# Altium schematic sheet DE-130817_01.SchDoc: Cuc & Com
size A3; Author: eldar6776@hotmail.com; DrawnBy: Eldar Dedic; Organization: I-MEDIA GROUP d.o.o.; Address1: Topal Osman Paše 18; Address2: 71000 Sarajevo; Address3: Federacija BiH; Address4: Bosna i Hercegovina; DocumentNumber: DE-130817; Revision: 001
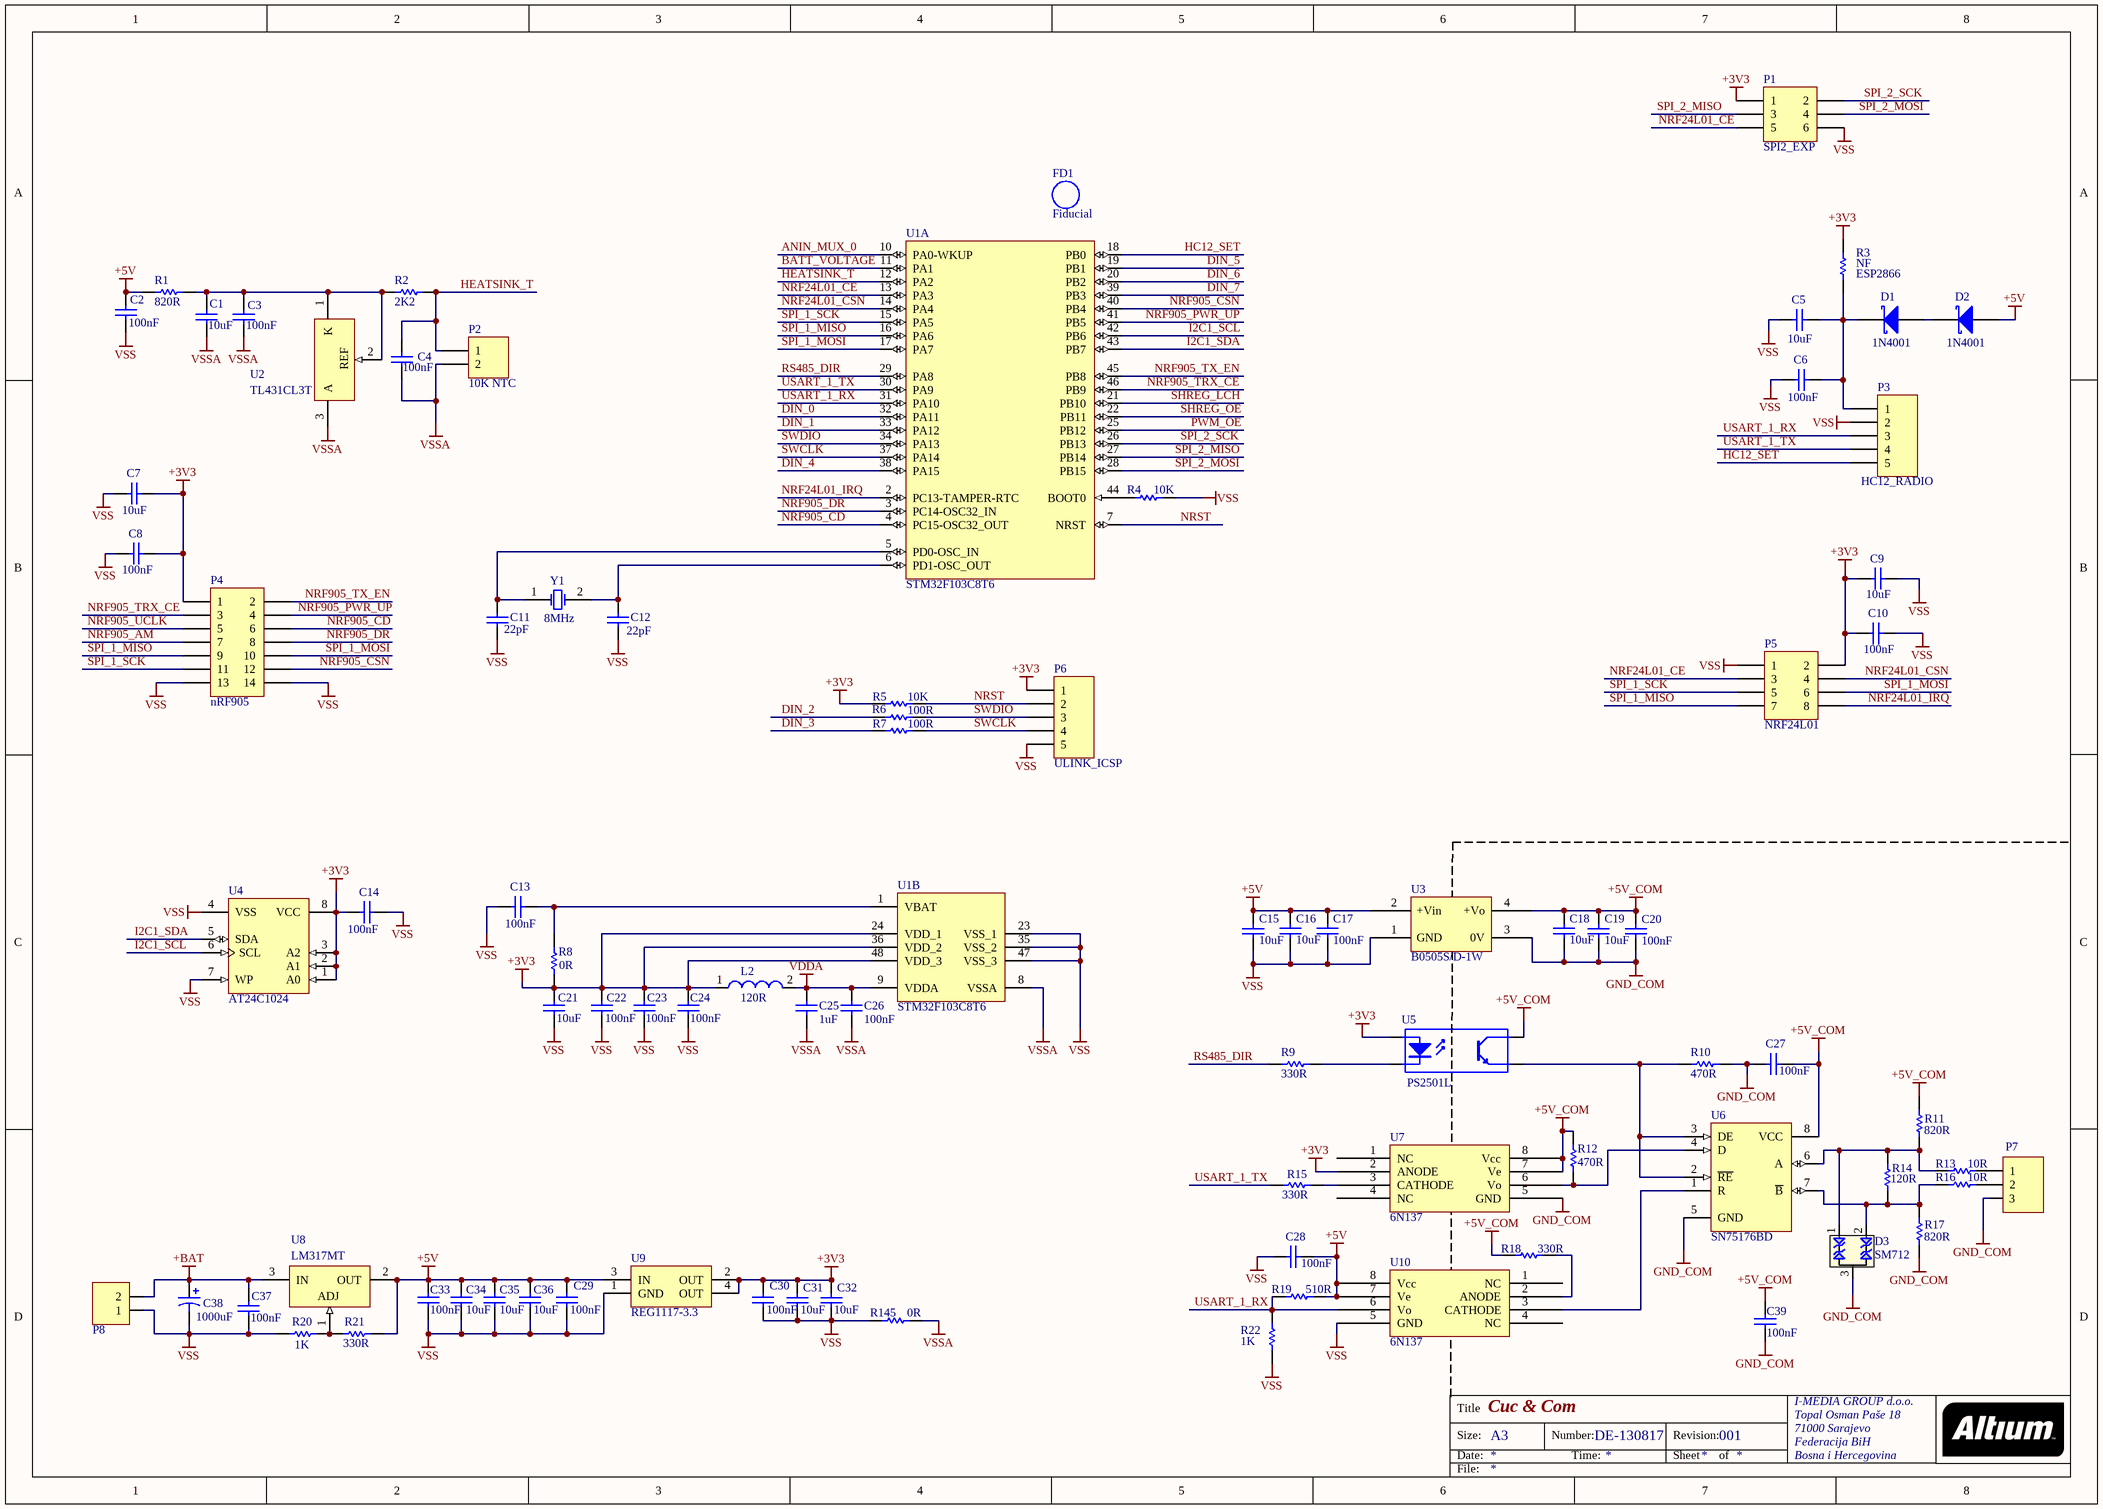
[diagram p0: DE-130817_01.SchDoc]

## Parts
C1  10uF  [0805]
C2  100nF  [0603]
C3  100nF  [0603]
C4  100nF  [0603]
C5  10uF  [0805]
C6  100nF  [0603]
C7  10uF  [0805]
C8  100nF  [0603]
C9  10uF  [0805]
C10  100nF  [0603]
C11  22pF  [0603]
C12  22pF  [0603]
C13  100nF  [0603]
C14  100nF  [0603]
C15  10uF  [0805]
C16  10uF  [0805]
C17  100nF  [0603]
C18  10uF  [0805]
C19  10uF  [0805]
C20  100nF  [0603]
C21  10uF  [0805]
C22  100nF  [0603]
C23  100nF  [0603]
C24  100nF  [0603]
C25  1uF  [0603]
C26  100nF  [0603]
C27  100nF  [0603]
C28  100nF  [0603]
C29  100nF  [0603]
C30  100nF  [0603]
C31  10uF  [0805]
C32  10uF  [0805]
C33  100nF  [0603]
C34  10uF  [0805]
C35  10uF  [0805]
C36  10uF  [0805]
C37  100nF  [0603]
C38  1000uF  [CAPPR5-10x16]
C39  100nF  [0603]
D1  1N4001  [SMA]
D2  1N4001  [SMA]
D3  SM712  [SOT23_3L]
FD1  Fiducial  [Fiducial]  (no BOM)
L2  120R  [SMD-0805]
P1  SPI2_EXP  [HDR2X3]
P2  10K NTC  [HDR1X2]
P3  HC12_RADIO  [HDR1X5]
P4  nRF905  [HDR2X7]
P5  NRF24L01  [HDR2X4]
P6  ULINK_ICSP  [HDR1X5]
P7  TERMINAL BLOK 3  [TERMINAL BLOK 3]  (value not drawn)
P8  TERMINAL BLOK 2  [TERMINAL BLOK 2]  (value not drawn)
R1  820R  [ERA-0603]
R2  2K2  [ERA-0603]
R3  NF  [ERA-0603]
R4  10K  [ERA-0603]
R5  10K  [ERA-0603]
R6  100R  [ERA-0603]
R7  100R  [ERA-0603]
R8  0R  [ERA-0603]
R9  330R  [ERA-0603]
R10  470R  [ERA-0603]
R11  820R  [ERA-0805]
R12  470R  [ERA-0603]
R13  10R  [ERA-0805]
R14  120R  [ERA-0805]
R15  330R  [ERA-0603]
R16  10R  [ERA-0805]
R17  820R  [ERA-0805]
R18  330R  [ERA-0603]
R19  510R  [ERA-0603]
R20  1K  [ERA-0805]
R21  330R  [ERA-0805]
R22  1K  [ERA-0603]
R145  0R  [ERA-0603]
U1  STM32F103C8T6  [STM-LQFP48_N]  (parts A,B of 2)
U2  TL431CL3T  [SOT23-3_N]
U3  B0505S/D-1W  [B0505S-1W]
U4  AT24C1024  [SOIC-SN8_N]
U5  PS2501L  [SOP4]
U6  SN75176BD  [D008_L]
U7  6N137  [SMD-8]
U8  LM317MT  [221A-06]
U9  REG1117-3.3  [ZZ311]
U10  6N137  [SMD-8]
Y1  8MHz  [HC49/4H_SMX]

## Nets
+3V3: C7.1 C8.1 C9.1 C10.1 C14.1 C21.2 C22.2 C23.2 C24.2 C30.2 C31.2 C32.2 L2.1 P1.1 P4.1 P5.2 P6.1 R3.2 R5.2 R8.2 U1.24(VDD_1) U1.36(VDD_2) U1.48(VDD_3) U4.1(A0) U4.2(A1) U4.3(A2) U4.8(VCC) U5.1(A) U7.2(ANODE) U9.2(OUT) U9.4(OUT)
+5V: C2.2 C15.2 C16.2 C17.2 C28.1 C29.2 C33.2 C34.2 C35.2 C36.2 D2.1(A) R1.2 R19.1 R21.1 U3.2(+Vin) U8.2(OUT) U9.3(IN) U10.7(Ve) U10.8(Vcc)
+5V_COM: C18.2 C19.2 C20.2 C27.2 C39.1 R11.2 R12.1 R18.2 U3.4(+Vo) U5.4(C) U6.8(VCC) U7.7(Ve) U7.8(Vcc)
+BAT: C37.2 C38.1 P8.2 U8.3(IN)
GND_COM: C18.1 C19.1 C20.1 C27.1 C39.2 D3.3(GND) P7.3 R10.2 R17.1 U3.3(0V) U6.5(GND) U7.5(GND)
VDDA: C25.2 C26.2 L2.2 U1.9(VDDA)
VSS: C2.1 C5.2 C6.2 C7.2 C8.2 C9.2 C10.2 C11.1 C12.1 C13.2 C14.2 C15.1 C16.1 C17.1 C21.1 C22.1 C23.1 C24.1 C28.2 C29.1 C30.1 C31.1 C32.1 C33.1 C34.1 C35.1 C36.1 C37.1 C38.2 P1.6 P3.2 P4.13 P4.14 P5.1 P6.5 P8.1 R4.2 R20.2 R22.1 R145.1 U1.23(VSS_1) U1.35(VSS_2) U1.47(VSS_3) U3.1(GND) U4.4(VSS) U4.7(WP) U9.1(GND) U10.5(GND)
VSSA: C1.1 C3.1 C4.1 C25.1 C26.1 P2.2 R145.2 U1.8(VSSA) U2.3(A)
ANIN_MUX_0: U1.10(PA0-WKUP)
BATT_VOLTAGE: U1.11(PA1)
DIN_0: U1.32(PA11)
DIN_1: U1.33(PA12)
DIN_2: R6.2
DIN_3: R7.2
DIN_4: U1.38(PA15)
DIN_5: U1.19(PB1)
DIN_6: U1.20(PB2)
DIN_7: U1.39(PB3)
HC12_SET: P3.5 U1.18(PB0)
HEATSINK_T: C4.2 P2.1 R2.1 U1.12(PA2)
I2C1_SCL: U1.42(PB6) U4.6(SCL)
I2C1_SDA: U1.43(PB7) U4.5(SDA)
NRF24L01_CE: P1.5 P5.3 U1.13(PA3)
NRF24L01_CSN: P5.4 U1.14(PA4)
NRF24L01_IRQ: P5.8 U1.2(PC13-TAMPER-RTC)
NRF905_AM: P4.7
NRF905_CD: P4.6 U1.4(PC15-OSC32_OUT)
NRF905_CSN: P4.12 U1.40(PB4)
NRF905_DR: P4.8 U1.3(PC14-OSC32_IN)
NRF905_PWR_UP: P4.4 U1.41(PB5)
NRF905_TRX_CE: P4.3 U1.46(PB9)
NRF905_TX_EN: P4.2 U1.45(PB8)
NRF905_UCLK: P4.5
NRST: P6.2 R5.1 U1.7(NRST)
PWM_OE: U1.25(PB12)
RS485_DIR: R9.2 U1.29(PA8)
SHREG_LCH: U1.21(PB10)
SHREG_OE: U1.22(PB11)
SPI_1_MISO: P4.9 P5.7 U1.16(PA6)
SPI_1_MOSI: P4.10 P5.6 U1.17(PA7)
SPI_1_SCK: P4.11 P5.5 U1.15(PA5)
SPI_2_MISO: P1.3 U1.27(PB14)
SPI_2_MOSI: P1.4 U1.28(PB15)
SPI_2_SCK: P1.2 U1.26(PB13)
SWCLK: P6.4 R7.1 U1.37(PA14)
SWDIO: P6.3 R6.1 U1.34(PA13)
USART_1_RX: P3.3 R19.2 R22.2 U1.31(PA10) U10.6(Vo)
USART_1_TX: P3.4 R15.1 U1.30(PA9)
NetC1_2: C1.2 C3.2 R1.1 R2.2 U2.1(K) U2.2(REF)
NetC5_1: C5.1 C6.1 D1.2(K) P3.1 R3.1
NetC11_2: C11.2 U1.5(PD0-OSC_IN) Y1.1(OSC1)
NetC12_2: C12.2 U1.6(PD1-OSC_OUT) Y1.2(OSC2)
NetC13_1: C13.1 R8.1 U1.1(VBAT)
NetD1_1: D1.1(A) D2.2(K)
NetD3_1: D3.1(I/O) R11.1 R13.1 R14.2 U6.6(A)
NetD3_2: D3.2(I/O) R14.1 R16.1 R17.2 U6.7(~{B})
NetP7_1: P7.1 R13.2
NetP7_2: P7.2 R16.2
NetR4_1: R4.1 U1.44(BOOT0)
NetR9_1: R9.1 U5.2(K)
NetR10_1: R10.1 U5.3(E) U6.2(~{RE}) U6.3(DE)
NetR12_2: R12.2 U6.4(D) U7.6(Vo)
NetR15_2: R15.2 U7.3(CATHODE)
NetR18_1: R18.1 U10.2(ANODE)
NetR20_1: R20.1 R21.2 U8.1(ADJ)
NetU6_1: U6.1(R) U10.3(CATHODE)

Not connected (* = marked no-connect by the designer): U7 1(NC) 4(NC); U10 1(NC) 4(NC)

## Notes on the sheet
- (near R3) ESP2866
- Title
- Size:
- Date:
- A3
- Number:
- Time:
- Revision:
- Sheet
- of
- File:

## Library data of the parts
C1 C5 C7 C9 C15 C16 C18 C19 C21 C31 C32 C34-C36 = C0805: Ceramic Chip Capacitor - Standard; Note: Footprint corresponds to dimensions for bulk cassette packaging. This case size has tightened tolerances.; Published: 17-Jul-2002; LatestRevisionDate: 19-Mar-2004; LatestRevisionNote: Silkscreen size reduced.; DatasheetDocument: Mar-2001; PackageDocument: Mar-2001; PackageReference: 0805; Publisher: Altium Limited; Code_JEITA: 0805; Code_IPC: 2012[0805]; ComponentLink1Description: Manufacturer Link; ComponentLink1URL: http://www.kemet.com/; ComponentLink2Description: Datasheet; ComponentLink2URL: http://www.kemet.com/kemet/web/homepage/kechome.nsf/vapubfilesname/F3102TA.pdf/$file/F3102TA.pdf
  C1 C5 C7 C9 C21: Value: 10uF
C2-C4 C6 C8 C10-C14 C17 C20 C22-C30 C33 C37 C39 = C0603: Ceramic Chip Capacitor - Standard; Note: Footprint corresponds to dimensions for bulk cassette packaging. This case size has tightened tolerances.; Published: 17-Jul-2002; LatestRevisionDate: 19-Mar-2004; LatestRevisionNote: Silkscreen size reduced.; DatasheetDocument: Mar-2001; PackageDocument: Mar-2001; PackageReference: 0603; Publisher: Altium Limited; Code_JEITA: 0603; Code_IPC: 1608 [0603]; ComponentLink1Description: Manufacturer Link; ComponentLink1URL: http://www.kemet.com/; ComponentLink2Description: Datasheet; ComponentLink2URL: http://www.kemet.com/kemet/web/homepage/kechome.nsf/vapubfilesname/F3102TA.pdf/$file/F3102TA.pdf
  C2-C4 C6 C8 C10 C13 C14 C22-C24 C26 C37: Value: 100nF
  C11 C12: Value: 22pF
  C25: Value: 1uF
C38 = EKA00DD410D00: Aluminum Electrolytic Capacitor, Radial Style with Long Leads: 1000uF, 16V; Note: Refer to Manufacturer's Data Sheets for other lead formations; DrillSize: Nominal, Rounded To The Nearest 0.1mm; Published: 19-Mar-2004; DatasheetDocument: 20-Feb-2001; PackageReference: CAPPR5-10X16; Publisher: Altium Limited; ComponentLink1Description: Manufacturer Link; ComponentLink1URL: http://www.vishay.com/; ComponentLink2Description: Datasheet; ComponentLink2URL: http://www.vishay.com/docs/25014/eka.pdf; Value: 1000uF
D1 D2 = 10MQ060N: Schottky Rectifier; Published: 17-Sep-2003; DatasheetVersion: May-2002; PackageVersion: revH, May-2002; PackageReference: SMA; Publisher: Altium Limited; PackageDescription: DO-214-AC/SMA; 2 C-Bend Leads; Body 5 x 2.7 mm, inc. leads (LxW); ComponentLink1Description: Manufacturer Link; ComponentLink1URL: http://www.irf.com/; ComponentLink2Description: Datasheet; ComponentLink2URL: http://www.irf.com/product-info/datasheets/data/10MQ060N.pdf
D3 = 824022: TVS Diode WE-TVS-Standard, VRWM=5.0V; Reverse Stand Off Voltage: 5V; PackageReference: SOT23_3L; PartNumber: 824022; ComponentLink1Description: Manufacturer URL; ComponentLink1URL: http://www.we-online.com; ComponentLink2Description: Datasheet; ComponentLink2URL: http://katalog.we-online.de/kataloge/eisos/media/pdf/824022.pdf
FD1 = Fiduchial: Fiduchial mark
L2 = 74279202: SMD EMI Suppression Ferrite Bead WE-CBF, Z = 120 Ohm; Impedance: 120 Ohm; DatasheetVersion: Dec-2005; PackageReference: SMD-0805; PackageDescription: Chip Inductor, 2-Leads, Body 2.0 x 1.2 mm; PartNumber: 74279202; ComponentLink1Description: Manufacturer URL; ComponentLink1URL: http://www.we-online.com; ComponentLink2Description: Datasheet; ComponentLink2URL: http://www.we-online.de/katalog/media/pdf/74279202.pdf
P1 = Header 3X2: Header, 3-Pin, Dual row; LatestRevisionDate: 17-Jul-2002; LatestRevisionNote: Re-released for DXP Platform.; Publisher: Altium Limited
P2 = Header 2: Header, 2-Pin; LatestRevisionDate: 17-Jul-2002; LatestRevisionNote: Re-released for DXP Platform.; Publisher: Altium Limited
P3 P6 = Header 5: Header, 5-Pin; LatestRevisionDate: 17-Jul-2002; LatestRevisionNote: Re-released for DXP Platform.; Publisher: Altium Limited
P4 = Header 7X2: Header, 7-Pin, Dual row; LatestRevisionDate: 17-Jul-2002; LatestRevisionNote: Re-released for DXP Platform.; Publisher: Altium Limited
P5 = Header 4X2: Header, 4-Pin, Dual row; LatestRevisionDate: 17-Jul-2002; LatestRevisionNote: Re-released for DXP Platform.; Publisher: Altium Limited
P7 = TERMINAL BLOK 3: 3 pinski terminal blok konektor
P8 = TERMINAL BLOK 2: 2 pinski terminal blok
R1-R3 R9 R10 R12 R18 R19 R22 R145 = ERAV: Metal Film Thermosensitive Chip Resistor, 0.56 Ohm to 10k Ohm Range, 5% Tolerance, 0603 Size, 0.063 W; Note: If flow soldering, adjust pad width of PCB Footprint to 0.7 - 0.8 times the width of the resistor.; Published: 17-Dec-2003; LatestRevisionDate: 19-Mar-2004; LatestRevisionNote: Silkscreen size reduced.; PackageDocument: Mar-2003; PackageReference: ERA-0603; Publisher: Altium Limited; Code_IPC: 1608 [0603]; ComponentLink1Description: Manufacturer Link; ComponentLink1URL: http://www.panasonic.com/industrial/components/resistive_products.htm; ComponentLink2Description: Datasheet; ComponentLink2URL: http://www.panasonic.com/industrial/components/pdf/AOF0000CE1.pdf
R4-R8 R15 = ERA3Y: Rectangular Thick Film Chip Resistor, 10 Ohm to 330k Ohm Range, 0.1% and 0.5% Tolerance, 0603 Size, 0.063 W; Note: If flow soldering, adjust pad width of PCB Footprint to 0.7 - 0.8 times the width of the resistor.; Published: 17-Dec-2003; LatestRevisionDate: 19-Mar-2004; LatestRevisionNote: Silkscreen size reduced.; PackageDocument: Mar-2003; PackageReference: ERA-0603; Publisher: Altium Limited; Code_IPC: 1608 [0603]; ComponentLink1Description: Manufacturer Link; ComponentLink1URL: http://www.panasonic.com/industrial/components/resistive_products.htm; ComponentLink2Description: Datasheet; ComponentLink2URL: http://www.panasonic.com/industrial/components/pdf/AOA0000CE8.pdf
  R4 R5: Value: 10K
  R6 R7: Value: 100R
  R8: Value: 0R
  R15: Value: 330R
R11 R13 R14 R16 R17 R20 R21 = ERA6Y: Rectangular Thick Film Chip Resistor, 10 Ohm to 1M Ohm Range, 0.1% and 0.5% Tolerance, 0805 Size, 0.1 W; Note: If flow soldering, adjust pad width of PCB Footprint to 0.7 - 0.8 times the width of the resistor.; Published: 17-Dec-2003; LatestRevisionDate: 19-Mar-2004; LatestRevisionNote: Silkscreen size reduced.; PackageDocument: Mar-2003; PackageReference: ERA-0805; Publisher: Altium Limited; Code_IPC: 2012 [0805]; ComponentLink1Description: Manufacturer Link; ComponentLink1URL: http://www.panasonic.com/industrial/components/resistive_products.htm; ComponentLink2Description: Datasheet; ComponentLink2URL: http://www.panasonic.com/industrial/components/pdf/AOA0000CE8.pdf
  R11 R17: Value: 820R
  R13 R16: Value: 10R
  R14: Value: 120R
  R20: Value: 1K
  R21: Value: 330R
U1 = STM32F103C8T6: ARM Cortex-M3 32-bit MCU, 64 KB Flash, 20 KB Internal RAM, 37 I/Os, 48-pin LQFP, -40 to 85 degC, Tray; A/D Converter: 2x12-bit (10 Channel); FLASH Size (Prog) (kB): 64; I/Os (High Current): 37; Internal RAM Size (kB): 20; Operating Frequency(F) (Processor speed) (MHz): 72; Supply Voltage(Vcc) min (V): 2; DatasheetVersion: Rev. 16; PackageVersion: Rev. 6, 06/2013; PackageReference: LQFP48; PackageDescription: 48-Pin Low Profile Quad Flat Package, 7 x 7 mm Body, 0.5 mm Pitch; Supplier 1: Digi-Key; Supplier Part Number 1: 497-6063-ND; Supplier 2: Farnell; Supplier Part Number 2: 1447637; Supplier 3: Newark; Supplier Part Number 3: 59M2182; Supplier 4: Newark; Supplier Part Number 4: 57P1222; Supplier 5: Mouser; Supplier Part Number 5: 511-STM32F103C8T6; Core: ARM Cortex-M3; Packing: Tray; Mounting Technology: Surface Mount; PartNumber: STM32F103C8T6; ComponentLink1Description: Manufacturer URL; ComponentLink1URL: http://www.st.com/web/en/home.html; ComponentLink2Description: Datasheet; ComponentLink2URL: http://www.st.com/st-web-ui/static/active/en/resource/technical/document/datasheet/CD00161566.pdf; ComponentLink3Description: Package Specification; ComponentLink3URL: http://www.st.com/st-web-ui/static/active/en/resource/technical/document/datasheet/DM00058181.pdf
U2 = TL431CL3T: Programmable Voltage Reference, 2.5 to 36V, 3-Pin SOT23-3, Tape and Reel; DatasheetVersion: Oct-2011; PackageVersion: 2011; PackageReference: SOT23-3; PackageDescription: 3-Pin SOT-23 Package 0.95 mm Pitch, 2.4 mm Lead Span; ComponentLink1Description: Manufacturer URL; ComponentLink1URL: http://www.st.com; ComponentLink2Description: Datasheet; ComponentLink2URL: http://www.st.com/internet/com/TECHNICAL_RESOURCES/TECHNICAL_LITERATURE/DATASHEET/CD00000986.pdf
U3 = B0505S/D: 1W isolated dc dc converter
U4 = 24AA64/SN: 64Kbit, 400kHz, 1.7V, I2C Serial EEPROM, 8-Pin SOIC 150mil, Commercial Temperature; Published: 29-Jan-2009; DatasheetVersion: revQ, Jun-2009; PackageVersion: revBB, Aug-2009; PackageReference: SOIC-SN8; Publisher: Altium Limited; PackageDescription: 8-Lead Plastic Small Outline (SN) - Narrow, 3.90mm Body [SOIC]; Supplier 1: Digi-Key; Supplier Part Number 1: 24AA64/SN-ND; Code_JEDEC: MS-012; Code_IPC: SOIC127P600-8; ComponentLink1Description: Datasheet; ComponentLink1URL: http://ww1.microchip.com/downloads/en/DeviceDoc/21189Q.pdf; ComponentLink2Description: Packaging Specification; ComponentLink2URL: http://www.microchip.com/stellent/groups/techpub_sg/documents/packagingspec/en012702.pdf; ComponentLink3Description: Microchip.com Home; ComponentLink3URL: http://www.microchip.com/
U5 = PC817 optocoupler: 4-Pin Phototransistor Optocoupler; Published: 24-Mar-1999; LatestRevisionDate: 04-Mar-2005; LatestRevisionNote: Sch pins 3 & 4 Swapped.; DatasheetVersion: Nov-2003; PackageReference: DIP-4; Publisher: Altium Limited
U6 = SN75176BD: Differential Bus Transceiver; Note: Receiver Hysteresis of 50mV Typical; Published: 15-May-2002; LatestRevisionDate: 13-Apr-2006; LatestRevisionNote: IPC-7351 Footprint Added.; DatasheetVersion: Sep-1989; PackageVersion: Jan-1998; PackageReference: D008; Publisher: Altium Limited; PackageDescription: 8-Pin Small Outline Integrated Circuit 1.27 mm Pitch; Code_IPC: SOIC127P600-8; ComponentLink1Description: Manufacturer Link; ComponentLink1URL: http://www.ti.com/; ComponentLink2Description: Datasheet; ComponentLink2URL: http://www-s.ti.com/sc/ds/sn75176b.pdf
U7 U10 = 6N137: High CMR, High Speed TTL Compatibile Optocoupler
U8 = LM317MT: Three-Terminal Adjustable Output Positive Voltage Regulator; Note: Heatsink surface connected to Pin 2; Published: 15-Apr-2002; DatasheetVersion: Nov-1999; PackageVersion: 1997; PackageReference: 221A-06; Publisher: Altium Limited; PackageDescription: TO, Thru-Hole, Vertical, Heatsink Mounted; 3 In-Line Leads; Pitch 2.54 mm; Code_JEDEC: TO-262-AA; ComponentLink1Description: Manufacturer Link; ComponentLink1URL: http://www.onsemi.com/site/products/taxonomy/0,4438,503,00.html; ComponentLink2Description: Datasheet; ComponentLink2URL: http://www.onsemi.com/pub/Collateral/LM317M-D.PDF
U9 = REG1117-3.3: 800mA and 1A Low Dropout Positive Regulator 2.85V, 3.3V, 5V, and Adjustable; Published: 8-Jun-2000; LatestRevisionDate: 17-Jul-2002; LatestRevisionNote: Re-released for DXP Platform.; DatasheetVersion: Sep-1997; PackageVersion: revC; PackageReference: ZZ311; Publisher: Altium Limited; PackageDescription: SOT-223/SC-73; 4 Leads; Body 6.7 x 7.3 mm, inc. leads (LxW max); ComponentLink1Description: Manufacturer Link; ComponentLink1URL: http://www.ti.com/; ComponentLink2Description: Datasheet; ComponentLink2URL: http://www-s.ti.com/sc/ds/REG1117.pdf
Y1 = HC49/4H_SMX: Surface Mount Quartz Crystal; Note: PCB layout complies with manufacturer's recommendation.; Published: 17-Jul-2002; DatasheetDocument: 18-Oct-1999; PackageDocument: 18-Oct-1999; PackageReference: HC49/4H_SMX; Publisher: Altium Limited; ComponentLink1Description: Manufacturer Link; ComponentLink1URL: http://www.cmac.com/mt/; ComponentLink2Description: Datasheet; ComponentLink2URL: http://www.cmac.com/mt/databook/crystals/smd/hc49_4h_smx.pdf